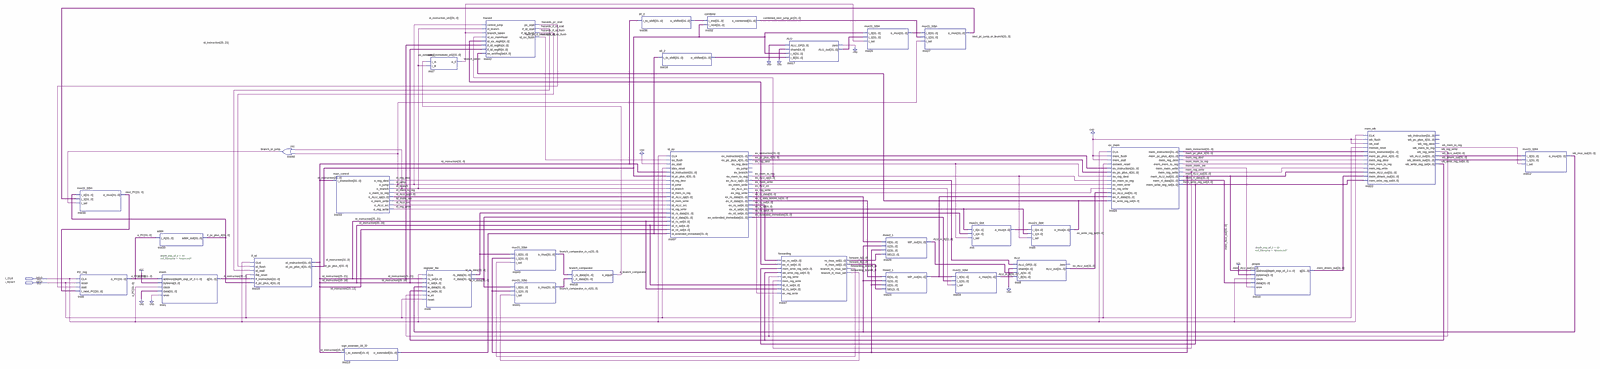
[diagram p0: schematic sheet, whole]
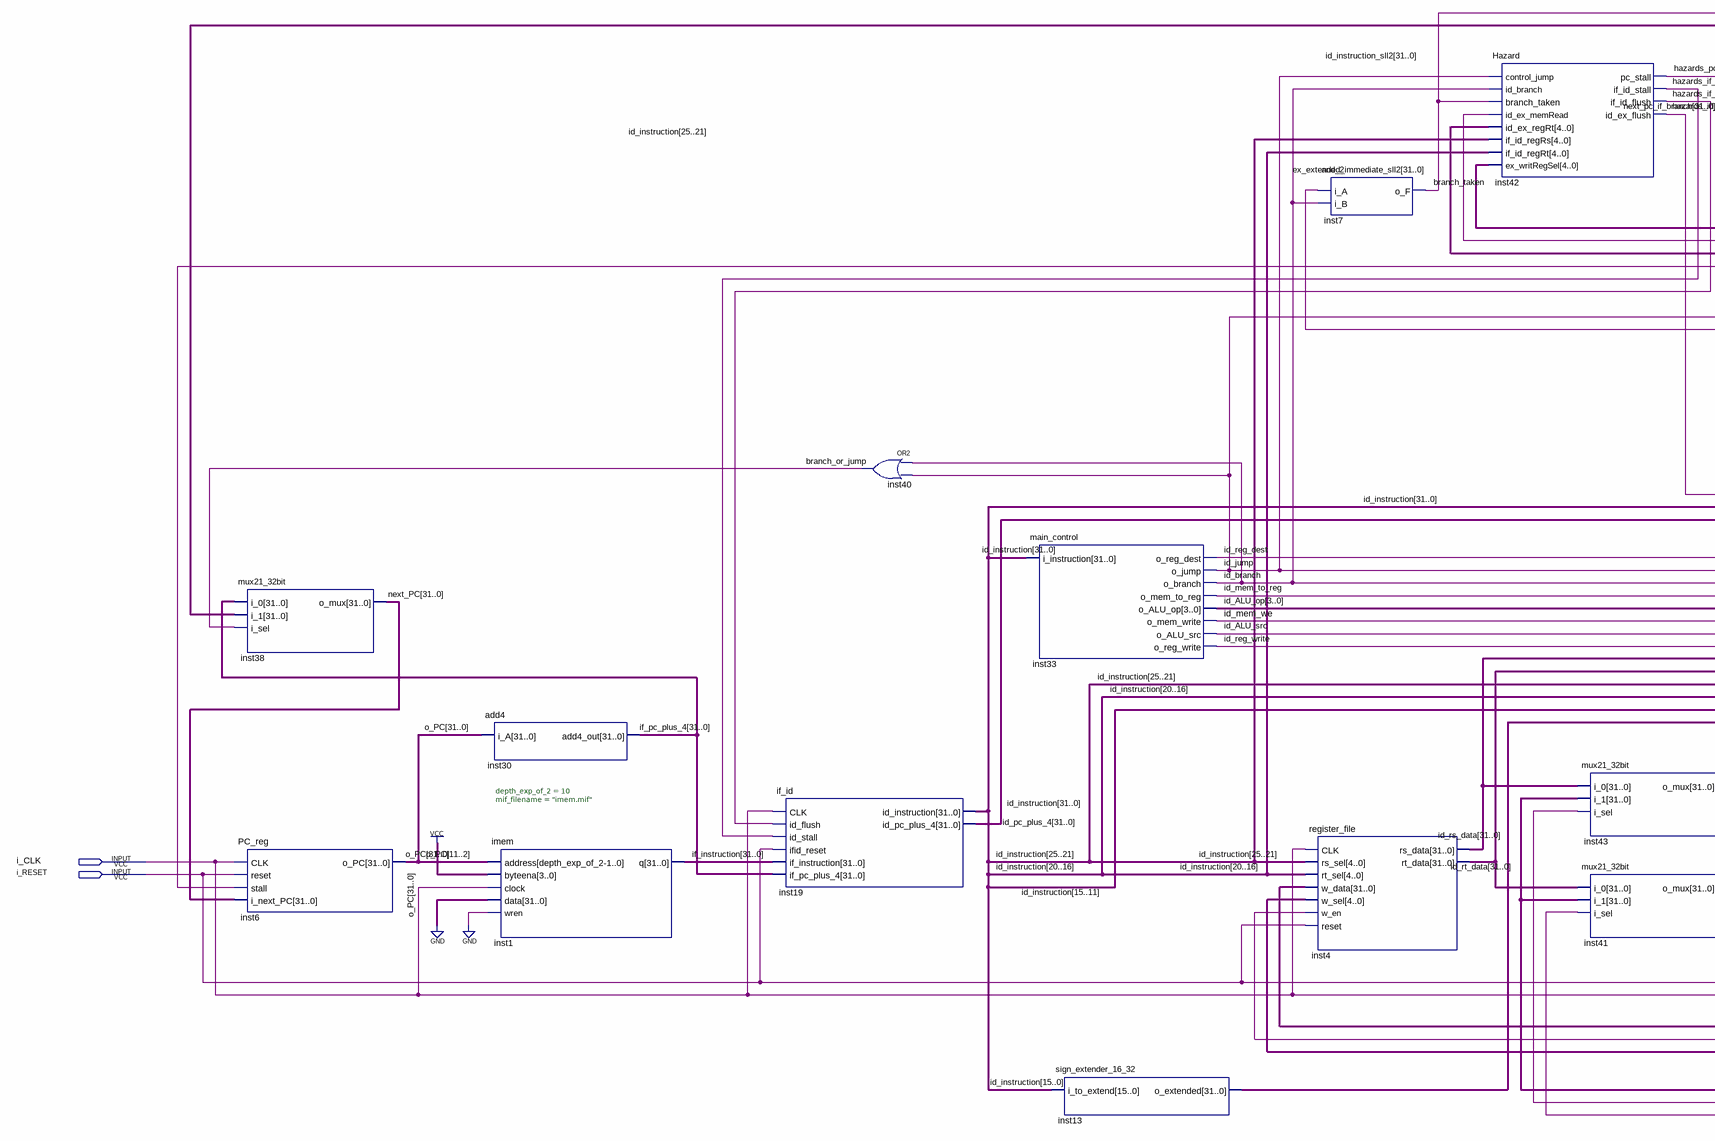
[diagram p1: schematic sheet, left part]
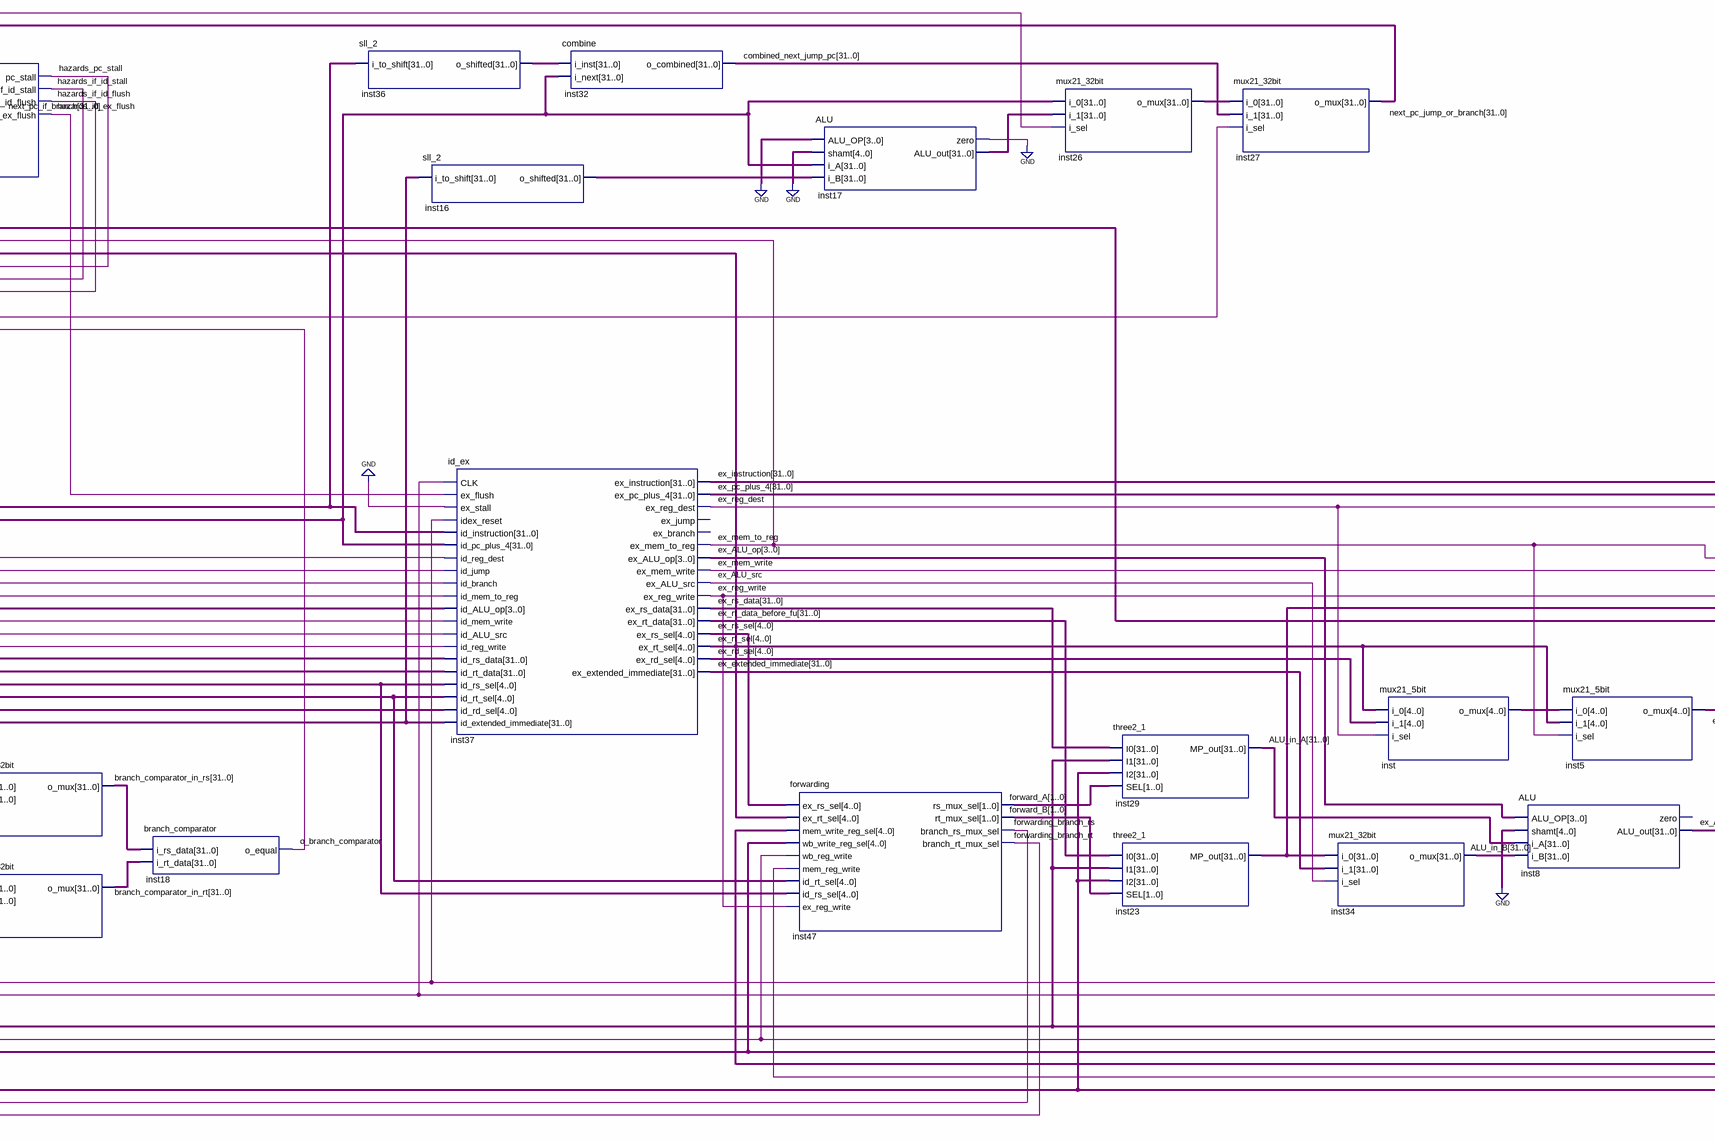
[diagram p2: schematic sheet, centre part]
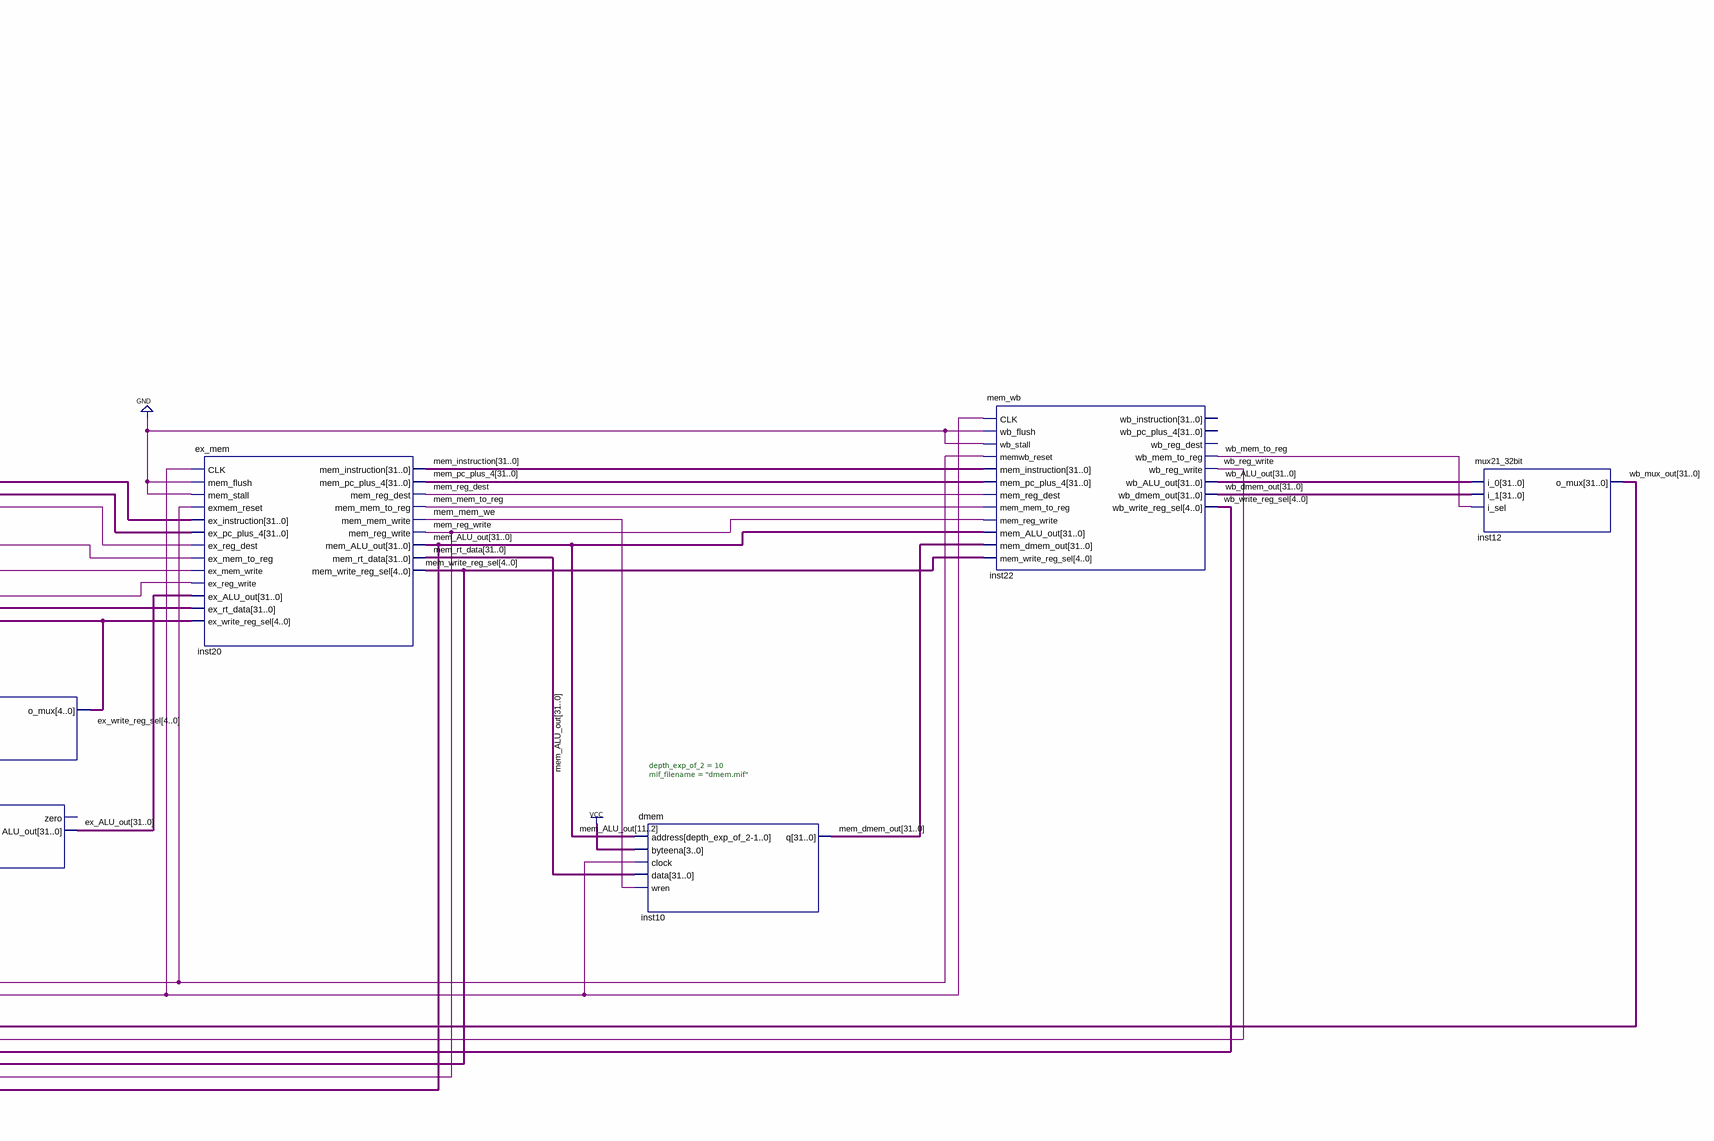
[diagram p3: schematic sheet, right part]
// Quartus schematic projA.bdf as structural Verilog: 32 symbols, 2 pins
module projA (
  input  i_CLK,
  input  i_RESET
);

  wire branch_or_jump, branch_taken, ex_ALU_src, ex_mem_to_reg, ex_mem_write, ex_reg_dest, ex_reg_write,
       forwarding_branch_rs, forwarding_branch_rt, hazards_id_ex_flush, hazards_if_id_flush,
       hazards_if_id_stall, hazards_pc_stall, id_ALU_src, id_branch, id_jump, id_mem_to_reg, id_mem_we,
       id_reg_dest, id_reg_write, inst17_zero, mem_mem_to_reg, mem_mem_we, mem_reg_dest, mem_reg_write,
       o_branch_comparator, wb_mem_to_reg, wb_reg_write;
  wire [1:0] forward_A, forward_B;
  wire [3:0] ex_ALU_op, id_ALU_op;
  wire [4:0] ex_rd_sel, ex_rs_sel, ex_rt_sel, ex_write_reg_sel, inst_o_mux, mem_write_reg_sel,
       wb_write_reg_sel;
  wire [31:0] ALU_in_A, ALU_in_B, branch_comparator_in_rs, branch_comparator_in_rt, combined_next_jump_pc,
       ex_ALU_out, ex_extended_immediate, ex_extended_immediate_sll2, ex_instruction, ex_pc_plus_4,
       ex_rs_data, ex_rt_data_before_fu, id_instruction, id_instruction_sll2, id_pc_plus_4, id_rs_data,
       id_rt_data, if_instruction, if_pc_plus_4, inst13_o_extended, inst23_mp_out, inst26_o_mux, mem_ALU_out,
       mem_dmem_out, mem_instruction, mem_pc_plus_4, mem_rt_data, next_PC, next_pc_if_branch,
       next_pc_jump_or_branch, o_PC, wb_ALU_out, wb_dmem_out, wb_mux_out;

  mux21_32bit inst38 (.i_0(if_pc_plus_4), .i_1(next_pc_jump_or_branch), .i_sel(branch_or_jump), .o_mux(next_PC));
  PC_reg inst6 (.CLK(i_CLK), .reset(i_RESET), .stall(hazards_pc_stall), .i_next_PC(next_PC), .o_PC(o_PC));
  add4 inst30 (.i_A(o_PC), .add4_out(if_pc_plus_4));
  imem #(.depth_exp_of_2(10), .mif_filename("imem.mif")) inst1 (
    .address(o_PC[11:2]), .byteena(4'b1111), .clock(i_CLK), .data({32{1'b0}}), .wren(1'b0), .q(if_instruction));
  if_id inst19 (
    .CLK(i_CLK), .id_flush(hazards_if_id_flush), .id_stall(hazards_if_id_stall), .ifid_reset(i_RESET),
    .if_instruction(if_instruction), .if_pc_plus_4(if_pc_plus_4), .id_instruction(id_instruction),
    .id_pc_plus_4(id_pc_plus_4));
  or inst40 (branch_or_jump, id_branch, id_jump);
  main_control inst33 (
    .i_instruction(id_instruction), .o_reg_dest(id_reg_dest), .o_jump(id_jump), .o_branch(id_branch),
    .o_mem_to_reg(id_mem_to_reg), .o_ALU_op(id_ALU_op), .o_mem_write(id_mem_we), .o_ALU_src(id_ALU_src),
    .o_reg_write(id_reg_write));
  sign_extender_16_32 inst13 (.i_to_extend(id_instruction[15:0]), .o_extended(inst13_o_extended));
  and_2 inst7 (.i_A(o_branch_comparator), .i_B(id_branch), .o_F(branch_taken));
  register_file inst4 (
    .CLK(i_CLK), .rs_sel(id_instruction[25:21]), .rt_sel(id_instruction[20:16]), .w_data(wb_mux_out),
    .w_sel(wb_write_reg_sel), .w_en(wb_reg_write), .reset(i_RESET), .rs_data(id_rs_data), .rt_data(id_rt_data));
  Hazard inst42 (
    .control_jump(id_jump), .id_branch(id_branch), .branch_taken(branch_taken),
    .id_ex_memRead(ex_mem_to_reg), .id_ex_regRt(ex_rt_sel), .if_id_regRs(id_instruction[25:21]),
    .if_id_regRt(id_instruction[20:16]), .ex_writRegSel(ex_write_reg_sel), .pc_stall(hazards_pc_stall),
    .if_id_stall(hazards_if_id_stall), .if_id_flush(hazards_if_id_flush), .id_ex_flush(hazards_id_ex_flush));
  mux21_32bit inst43 (
    .i_0(id_rs_data), .i_1(mem_ALU_out), .i_sel(forwarding_branch_rs), .o_mux(branch_comparator_in_rs));
  mux21_32bit inst41 (
    .i_0(id_rt_data), .i_1(mem_ALU_out), .i_sel(forwarding_branch_rt), .o_mux(branch_comparator_in_rt));
  branch_comparator inst18 (
    .i_rs_data(branch_comparator_in_rs), .i_rt_data(branch_comparator_in_rt), .o_equal(o_branch_comparator));
  sll_2 inst36 (.i_to_shift(id_instruction), .o_shifted(id_instruction_sll2));
  sll_2 inst16 (.i_to_shift(inst13_o_extended), .o_shifted(ex_extended_immediate_sll2));
  id_ex inst37 (
    .CLK(i_CLK), .ex_flush(hazards_id_ex_flush), .ex_stall(1'b0), .idex_reset(i_RESET),
    .id_instruction(id_instruction), .id_pc_plus_4(id_pc_plus_4), .id_reg_dest(id_reg_dest),
    .id_jump(id_jump), .id_branch(id_branch), .id_mem_to_reg(id_mem_to_reg), .id_ALU_op(id_ALU_op),
    .id_mem_write(id_mem_we), .id_ALU_src(id_ALU_src), .id_reg_write(id_reg_write), .id_rs_data(id_rs_data),
    .id_rt_data(id_rt_data), .id_rs_sel(id_instruction[25:21]), .id_rt_sel(id_instruction[20:16]),
    .id_rd_sel(id_instruction[15:11]), .id_extended_immediate(inst13_o_extended),
    .ex_instruction(ex_instruction), .ex_pc_plus_4(ex_pc_plus_4), .ex_reg_dest(ex_reg_dest),
    .ex_mem_to_reg(ex_mem_to_reg), .ex_ALU_op(ex_ALU_op), .ex_mem_write(ex_mem_write),
    .ex_ALU_src(ex_ALU_src), .ex_reg_write(ex_reg_write), .ex_rs_data(ex_rs_data),
    .ex_rt_data(ex_rt_data_before_fu), .ex_rs_sel(ex_rs_sel), .ex_rt_sel(ex_rt_sel), .ex_rd_sel(ex_rd_sel),
    .ex_extended_immediate(ex_extended_immediate));  // open: ex_jump, ex_branch
  combine inst32 (.i_inst(id_instruction_sll2), .i_next(id_pc_plus_4), .o_combined(combined_next_jump_pc));
  forwarding inst47 (
    .ex_rs_sel(ex_rs_sel), .ex_rt_sel(ex_rt_sel), .mem_write_reg_sel(mem_write_reg_sel),
    .wb_write_reg_sel(wb_write_reg_sel), .wb_reg_write(wb_reg_write), .mem_reg_write(mem_reg_write),
    .id_rt_sel(id_instruction[20:16]), .id_rs_sel(id_instruction[25:21]), .ex_reg_write(ex_reg_write),
    .rs_mux_sel(forward_A), .rt_mux_sel(forward_B), .branch_rs_mux_sel(forwarding_branch_rs),
    .branch_rt_mux_sel(forwarding_branch_rt));
  ALU inst17 (
    .ALU_OP(4'b0000), .shamt({5{1'b0}}), .i_A(id_pc_plus_4), .i_B(ex_extended_immediate_sll2),
    .zero(inst17_zero), .ALU_out(next_pc_if_branch));
  mux21_32bit inst26 (.i_0(id_pc_plus_4), .i_1(next_pc_if_branch), .i_sel(branch_taken), .o_mux(inst26_o_mux));
  three2_1 inst29 (.I0(ex_rs_data), .I1(wb_mux_out), .I2(mem_ALU_out), .SEL(forward_A), .MP_out(ALU_in_A));
  three2_1 inst23 (
    .I0(ex_rt_data_before_fu), .I1(wb_mux_out), .I2(mem_ALU_out), .SEL(forward_B), .MP_out(inst23_mp_out));
  mux21_32bit inst27 (.i_0(inst26_o_mux), .i_1(combined_next_jump_pc), .i_sel(id_jump), .o_mux(next_pc_jump_or_branch));
  mux21_32bit inst34 (.i_0(inst23_mp_out), .i_1(ex_extended_immediate), .i_sel(ex_ALU_src), .o_mux(ALU_in_B));
  mux21_5bit inst (.i_0(ex_rt_sel), .i_1(ex_rd_sel), .i_sel(ex_reg_dest), .o_mux(inst_o_mux));
  ALU inst8 (
    .ALU_OP(ex_ALU_op), .shamt({5{1'b0}}), .i_A(ALU_in_A), .i_B(ALU_in_B), .ALU_out(ex_ALU_out));  // open: zero
  mux21_5bit inst5 (.i_0(inst_o_mux), .i_1(ex_rt_sel), .i_sel(ex_mem_to_reg), .o_mux(ex_write_reg_sel));
  ex_mem inst20 (
    .CLK(i_CLK), .mem_flush(1'b0), .mem_stall(1'b0), .exmem_reset(i_RESET), .ex_instruction(ex_instruction),
    .ex_pc_plus_4(ex_pc_plus_4), .ex_reg_dest(ex_reg_dest), .ex_mem_to_reg(ex_mem_to_reg),
    .ex_mem_write(ex_mem_write), .ex_reg_write(ex_reg_write), .ex_ALU_out(ex_ALU_out),
    .ex_rt_data(inst23_mp_out), .ex_write_reg_sel(ex_write_reg_sel), .mem_instruction(mem_instruction),
    .mem_pc_plus_4(mem_pc_plus_4), .mem_reg_dest(mem_reg_dest), .mem_mem_to_reg(mem_mem_to_reg),
    .mem_mem_write(mem_mem_we), .mem_reg_write(mem_reg_write), .mem_ALU_out(mem_ALU_out),
    .mem_rt_data(mem_rt_data), .mem_write_reg_sel(mem_write_reg_sel));
  dmem #(.depth_exp_of_2(10), .mif_filename("dmem.mif")) inst10 (
    .address(mem_ALU_out[11:2]), .byteena(4'b1111), .clock(i_CLK), .data(mem_rt_data), .wren(mem_mem_we),
    .q(mem_dmem_out));
  mem_wb inst22 (
    .CLK(i_CLK), .wb_flush(1'b0), .wb_stall(1'b0), .memwb_reset(i_RESET), .mem_instruction(mem_instruction),
    .mem_pc_plus_4(mem_pc_plus_4), .mem_reg_dest(mem_reg_dest), .mem_mem_to_reg(mem_mem_to_reg),
    .mem_reg_write(mem_reg_write), .mem_ALU_out(mem_ALU_out), .mem_dmem_out(mem_dmem_out),
    .mem_write_reg_sel(mem_write_reg_sel), .wb_mem_to_reg(wb_mem_to_reg), .wb_reg_write(wb_reg_write),
    .wb_ALU_out(wb_ALU_out), .wb_dmem_out(wb_dmem_out), .wb_write_reg_sel(wb_write_reg_sel));  // open: wb_instruction, wb_pc_plus_4, wb_reg_dest
  mux21_32bit inst12 (.i_0(wb_ALU_out), .i_1(wb_dmem_out), .i_sel(wb_mem_to_reg), .o_mux(wb_mux_out));
  // also tied to GND on the sheet: inst17_zero
endmodule
